# Altium schematic sheet DS3231M.SchDoc
size A4; SheetNumber: 8; SheetTotal: 9
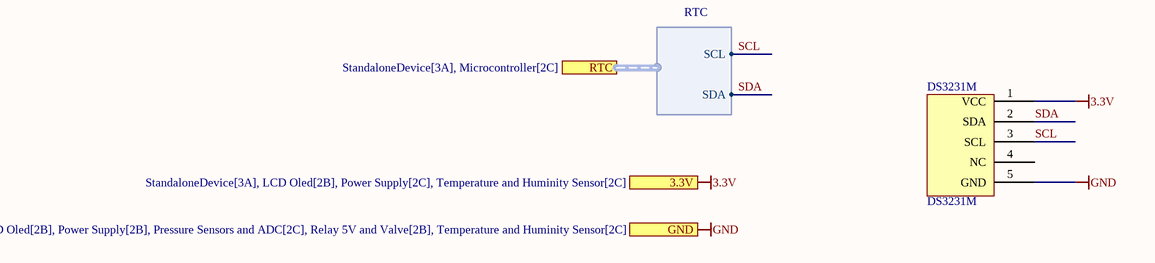
[diagram p0: DS3231M.SchDoc]

## Parts
DS3231M  DS3231M  [Module DS3231M]

## Ports
3.3V (see StandaloneDevice[3A], LCD Oled[2B], Power Supply[2C], Temperature and Huminity Sensor[2C]), GND (see StandaloneDevice[3A], LCD Oled[2B], Power Supply[2B], Pressure Sensors and ADC[2C], Relay 5V and Valve[2B], Temperature and Huminity Sensor[2C]), RTC (harness RTC, see StandaloneDevice[3A], Microcontroller[2C])

## Harnesses
RTC: SCL, SDA

## Nets
3.3V: DS3231M.1(VCC) ; port 3.3V
GND: DS3231M.5(GND) ; port GND
SCL: DS3231M.3(SCL) ; port RTC.SCL
SDA: DS3231M.2(SDA) ; port RTC.SDA

Not connected (* = marked no-connect by the designer): DS3231M 4(NC)